# EAGLE design H18R10 (EAGLE 9.6.2)

## Sheet 1 of 2
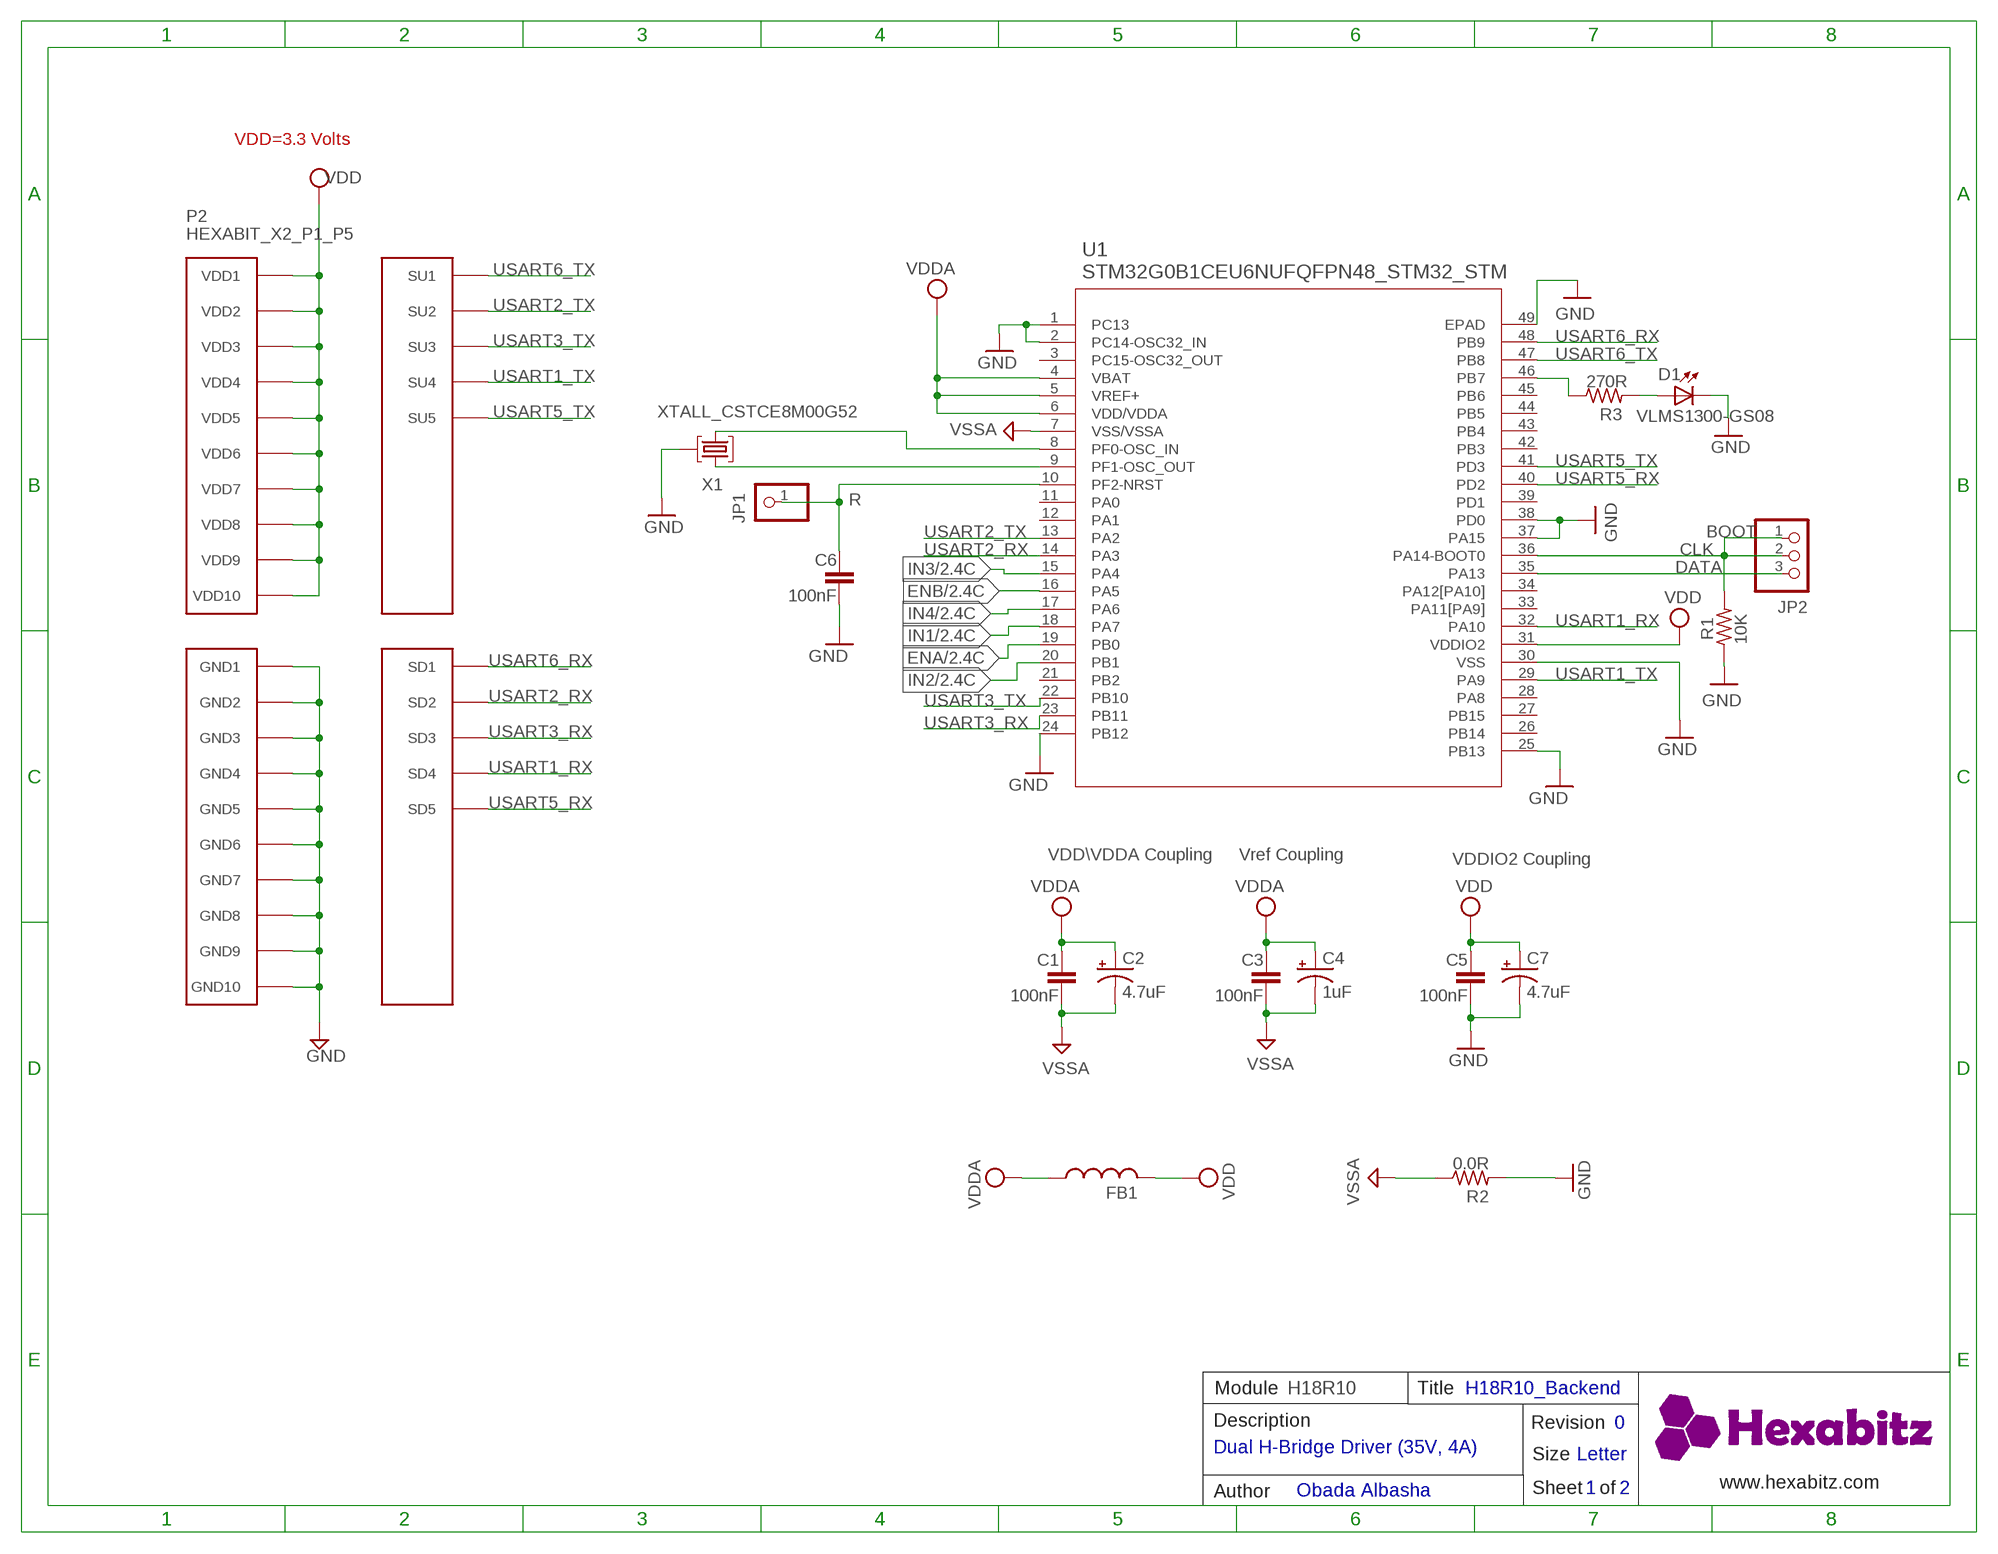
[diagram p0: schematic, sheet 1]

### Parts
C1  100nF  C-0603  [C-0603]
C2  4.7uF  C-0805-POL  [C-0805-POL]
C3  100nF  C-0603  [C-0603]
C4  1uF  C-0805-POL  [C-0805-POL]
C5  100nF  C-0603  [C-0603]
C6  100nF  C-0603  [C-0603]
C7  4.7uF  C-0805-POL  [C-0805-POL]
D1  VLMS1300-GS08  [VLMS1300-GS08]
FB1  FB-0603  [FB-0603]
JP1  R  PINHD-1X1  [1X01]
JP2  PINHD-1X3  [1X03]
P2  HEXABIT_X2_P1_P5  [HEXABIT_17.32_X2_P1_P5]
R1  10K  R-0603  [R-0603]
R2  0.0R  R-0603  [R-0603]
R3  270R  R-0603  [R-0603]
U1  STM32G0B1CEU6NUFQFPN48_STM32_STM  [UFQFPN48_STM32_STM]
X1  XTALL_CSTCE8M00G52  [XTALL_CSTCE8M00G52]

### Nets
CLK: JP2.1 JP2.2 R1.2 U1.36(PA14-BOOT0)
DATA: JP2.3 U1.35(PA13)
ENA: U1.19(PB0) ; also sheet 2
ENB: U1.16(PA5) ; also sheet 2
GND: C5.2 C6.2 C7.2(-) D1.C P2.PAD_PD11(GND1) P2.PAD_PD12(GND2) P2.PAD_PD13(GND3) P2.PAD_PD14(GND4) P2.PAD_PD15(GND5) P2.PAD_PD16(GND6) P2.PAD_PD17(GND7) P2.PAD_PD18(GND8) P2.PAD_PD19(GND9) P2.PAD_PD20(GND10) R1.1 R2.2 U1.1(PC13) U1.2(PC14-OSC32_IN) U1.24(PB12) U1.25(PB13) U1.30(VSS) U1.37(PA15) U1.38(PD0) U1.49(EPAD) X1.P$2 ; also sheet 2
IN1: U1.18(PA7) ; also sheet 2
IN2: U1.20(PB1) ; also sheet 2
IN3: U1.15(PA4) ; also sheet 2
IN4: U1.17(PA6) ; also sheet 2
N$1: D1.A R3.2
N$2: R3.1 U1.46(PB7)
N$5: U1.9(PF1-OSC_OUT) X1.P$1
N$6: U1.8(PF0-OSC_IN) X1.P$3
N$8: C6.1 JP1.1 U1.10(PF2-NRST)
USART1_RX: P2.PAD_PD4(SD4) U1.32(PA10)
USART1_TX: P2.PAD_PU4(SU4) U1.29(PA9)
USART2_RX: P2.PAD_PD2(SD2) U1.14(PA3)
USART2_TX: P2.PAD_PU2(SU2) U1.13(PA2)
USART3_RX: P2.PAD_PD3(SD3) U1.23(PB11)
USART3_TX: P2.PAD_PU3(SU3) U1.22(PB10)
USART5_RX: P2.PAD_PD5(SD5) U1.40(PD2)
USART5_TX: P2.PAD_PU5(SU5) U1.41(PD3)
USART6_RX: P2.PAD_PD1(SD1) U1.48(PB9)
USART6_TX: P2.PAD_PU1(SU1) U1.47(PB8)
VDD: C5.1 C7.1(+) FB1.2 P2.PAD_PU11(VDD1) P2.PAD_PU12(VDD2) P2.PAD_PU13(VDD3) P2.PAD_PU14(VDD4) P2.PAD_PU15(VDD5) P2.PAD_PU16(VDD6) P2.PAD_PU17(VDD7) P2.PAD_PU18(VDD8) P2.PAD_PU19(VDD9) P2.PAD_PU20(VDD10) U1.31(VDDIO2) ; also sheet 2
VDDA: C1.1 C2.1(+) C3.1 C4.1(+) FB1.1 U1.4(VBAT) U1.5(VREF+) U1.6(VDD/VDDA)
VSSA: C1.2 C2.2(-) C3.2 C4.2(-) R2.1 U1.7(VSS/VSSA)
Unconnected: U1.3(PC15-OSC32_OUT) U1.11(PA0) U1.12(PA1) U1.21(PB2) U1.26(PB14) U1.27(PB15) U1.28(PA8) U1.33(PA11[PA9]) U1.34(PA12[PA10]) U1.39(PD1) U1.42(PB3) U1.43(PB4) U1.44(PB5) U1.45(PB6)

### Notes on the sheet
- VDD=3.3 Volts
- BOOT
- VDD\VDDA Coupling | Vref Coupling | VDDIO2 Coupling
- Module | H18R10 | Title | H18R10_Backend
- Description | Revision | 0
- Dual H-Bridge Driver (35V, 4A)
- Size | Letter
- www.hexabitz.com
- Author | Obada Albasha | Sheet   of | 1 | 2
- C:/Users/Admin/Desktop/logodraft.bmp

## Sheet 2 of 2
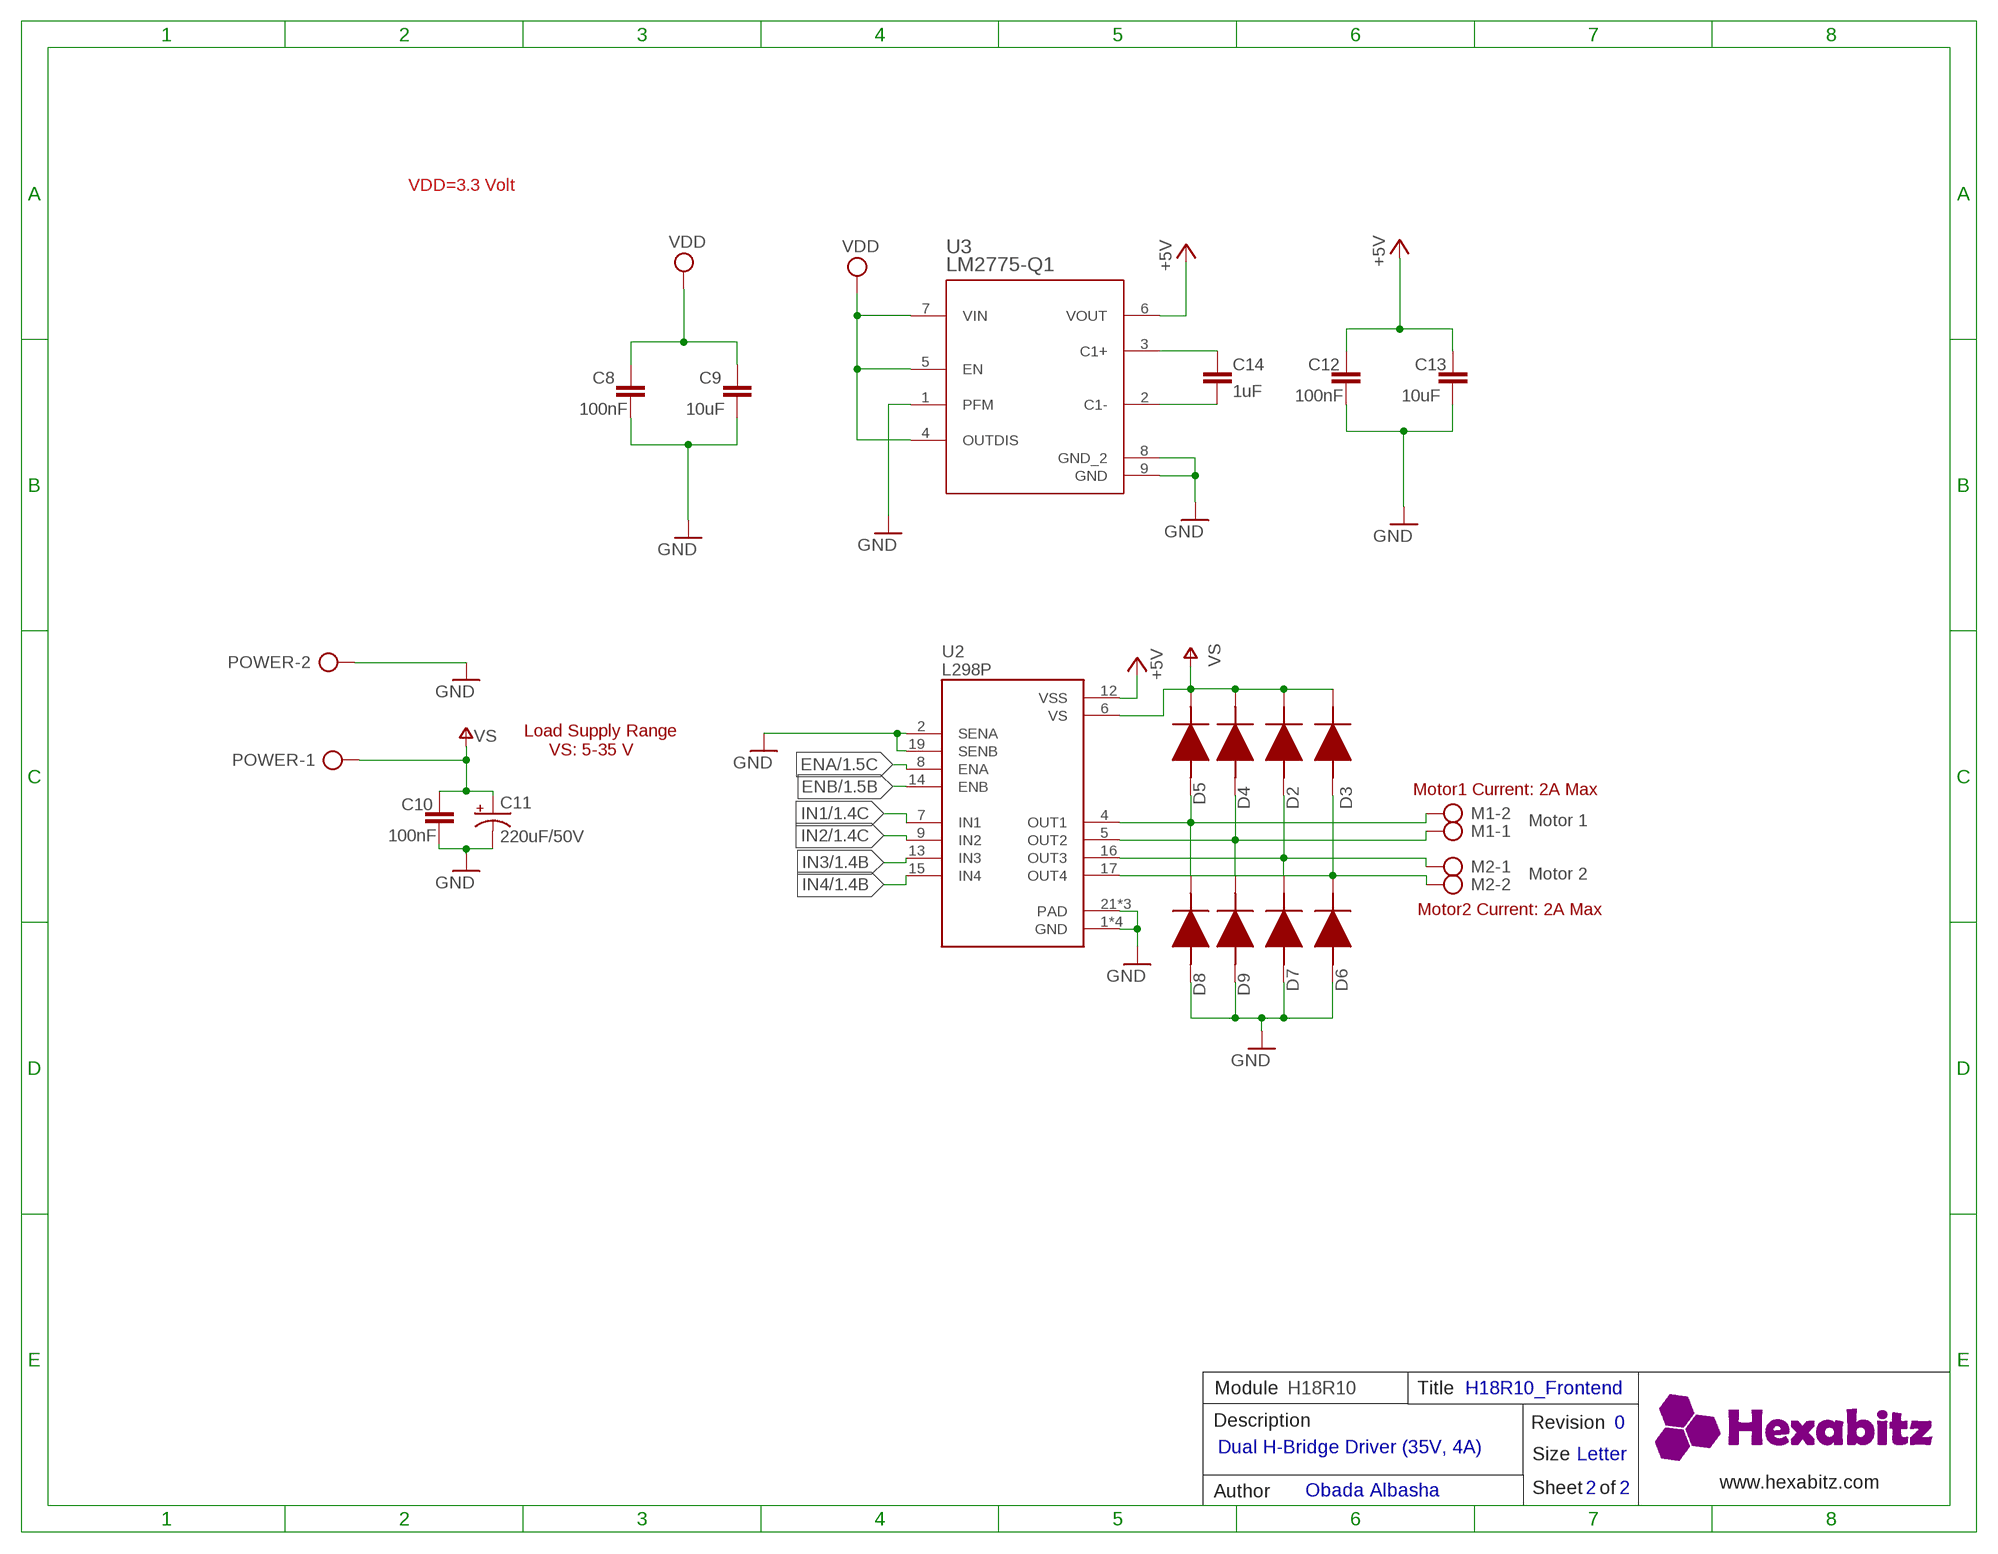
[diagram p1: schematic, sheet 2]

### Parts
C8  100nF  C-0603  [C-0603]
C9  10uF  C-0603  [C-0603]
C10  100nF  C-0603  [C-0603]
C11  220uF/50V  CPOL-USTT5D10  [TT5D10]
C12  100nF  C-0603  [C-0603]
C13  10uF  C-0603  [C-0603]
C14  1uF  C-0603  [C-0603]
D2  MBR120ESFT1G  [SODFL3616X98N]
D3  MBR120ESFT1G  [SODFL3616X98N]
D4  MBR120ESFT1G  [SODFL3616X98N]
D5  MBR120ESFT1G  [SODFL3616X98N]
D6  MBR120ESFT1G  [SODFL3616X98N]
D7  MBR120ESFT1G  [SODFL3616X98N]
D8  MBR120ESFT1G  [SODFL3616X98N]
D9  MBR120ESFT1G  [SODFL3616X98N]
M1  AK500/2  [AK500/2]
M2  AK500/2  [AK500/2]
POWER  AK500/2  [AK500/2]
U2  L298P  [SOIC127P1420X360-20N]
U3  LM2775-Q1  LM2775QDSGRQ1  [DSG0008A]

### Nets
+5V: C12.1 C13.1 U2.12(VSS) U3.6(VOUT)
ENA: U2.8(ENA) ; also sheet 1
ENB: U2.14(ENB) ; also sheet 1
GND: C8.2 C9.2 C10.2 C11.- C12.2 C13.2 D6.2(A) D7.2(A) D8.2(A) D9.2(A) POWER.2 U2.1(GND) U2.2(SENA) U2.10(GND) U2.11(GND) U2.19(SENB) U2.20(GND) U2.21(PAD) U2.22(PAD) U2.23(PAD) U3.1(PFM) U3.8(GND_2) U3.9(GND) ; also sheet 1
IN1: U2.7(IN1) ; also sheet 1
IN2: U2.9(IN2) ; also sheet 1
IN3: U2.13(IN3) ; also sheet 1
IN4: U2.15(IN4) ; also sheet 1
N$3: C14.2 U3.2(C1-)
N$4: C14.1 U3.3(C1+)
N$13: D4.2(A) D9.1(K) M1.1 U2.5(OUT2)
N$14: D2.2(A) D7.1(K) M2.1 U2.16(OUT3)
N$15: D5.2(A) D8.1(K) M1.2 U2.4(OUT1)
N$16: D3.2(A) D6.1(K) M2.2 U2.17(OUT4)
V+: C10.1 C11.+ D2.1(K) D3.1(K) D4.1(K) D5.1(K) POWER.1 U2.6(VS) ; supply symbol labelled VS
VDD: C8.1 C9.1 U3.4(OUTDIS) U3.5(EN) U3.7(VIN) ; also sheet 1

### Notes on the sheet
- VDD=3.3 Volt
- Load Supply Range
       VS: 5-35 V
- Motor1 Current: 2A Max
- Motor 1
- Motor 2
- Motor2 Current: 2A Max
- Module | H18R10 | Title | H18R10_Frontend
- Description | Revision | 0
- Dual H-Bridge Driver (35V, 4A)
- Size | Letter
- www.hexabitz.com
- Author | Obada Albasha | Sheet   of | 2 | 2
- C:/Users/Admin/Desktop/logodraft.bmp

## Library data of the parts
C1 C3 C5 C6 C8-C10 C12-C14 = HEXABITZ_RCLS:C-0603: CAP CER 10% X7R 0603
C2 C4 C7 = HEXABITZ_RCLS:C-0805-POL: Cap Tant Solid SMD 2012
C11 = rcl:CPOL-US: POLARIZED CAPACITOR, American symbol; SPICEPREFIX: C
D1 = Hexabitz:VLMS1300-GS08: Red 0603 130° Clear 54 mcd 2 V Surface Mount ChipLED ; Octopart Url : http://octopart.com/vlms1300-gs08-vishay-21709201; MFN: Vishay; MPN: VLMS1300-GS08; OCTOPART_URL: https://octopart.com/vlms1300-gs08-vishay-21709201?r=sp&s=_gcP4_q8T1SC6PJQPTQ9yA
D2-D9 = HEXABITZ_RCLS:MBR120ESFT1G: Source: Datasheet <http://www.onsemi.com/pub/Collateral/MBR120ESFT1-D.PDF>; ARROW_PART_NUMBER: FSM17PL-TP; ARROW_PRICE-STOCK: https://octopart.com/fsm17pl-tp-mcc-57606818?r=sp; MANUFACTURER_NAME: MCC; MANUFACTURER_PART_NUMBER: FSM17PL-TP; MOUSER_PRICE-STOCK: https://octopart.com/fsm17pl-tp-mcc-57606818?r=sp; PACKAGE: SOD-123FL
FB1 = HEXABITZ_RCLS:FB-0603: Ferrite Beads Multi-Layer 0603
JP1 = HEXABITZ_USER_INTERFACE_PARTS:PINHD-1X1: PIN HEADER; MFN: TE Connectivity; MPN: 87227-1; OCTOPART_URL: https://octopart.com/87227-1-te+connectivity-39512052?r=sp
JP2 = pinhead:PINHD-1X3: PIN HEADER
M1 M2 POWER = HEXABITZ_CONNECTION_PARTS:AK500/2: CONNECTOR; MFN: TE Connectivity; MPN: 282836-2; OCTOPART_URL: https://octopart.com/282836-2-te+connectivity-39396934?r=sp
P2 = hexabitz_connectors:HEXABIT_X2_P1_P5
R1-R3 = HEXABITZ_RCLS:R-0603: Thick Film Resistors - SMD 0603
U1 = HEXABITZ_ICs:STM32G0B1CEU6N; COPYRIGHT: Copyright (C) 2022 Ultra Librarian. All rights reserved.; MFN: STMicroelectronics; MPN: STM32G0B1CEU6N; OCTOPART_URL: https://app.ultralibrarian.com/details/c038d58b-752a-11eb-9033-0a34d6323d74/STMicroelectronics/STM32G0B1CEU6N?uid=116364672
U2 = HEXABITZ_ICs:L298P: L298 Series Dual Full Bridge 4 A 46 V Driver Surface Mount - PowerSO-20 Check availability <https://pricing.snapeda.com/parts/L298P/STMicroelectronics/view-part?ref=eda>; AVAILABILITY: In Stock; DESCRIPTION: Half Bridge (4) Driver DC Motors, Relays, Solenoids, Stepper Motors Bipolar PowerSO-20; MF: STMicroelectronics; MP: L298P; PACKAGE: SO-20 STMicroelectronics; PRICE: None; PURCHASE-URL: https://pricing.snapeda.com/search/part/L298P/?ref=eda
U3 = HEXABITZ_ICs:LM2775QDSGRQ1: Switched Capacitor 5V Boost Converter 8-WSON -40 to 125; MANUFACTURER: Texas Instruments; MFN: Texas Instruments; MPN: LM2775QDSGRQ1; OCTOPART_URL: https://octopart.com/lm2775qdsgrq1-texas+instruments-93339195?r=sp&s=OA7oim0HQqaBsU4tLKFWXg LM2775QDSGRQ1; PARTNUMBER: LM2775QDSGRQ1; REFDES: RefDes; TYPE: TYPE
X1 = Hexabitz:XTALL_CSTCE8M00G52: MURATA CSTCE8M00G52-R0 RESONATOR, SMD, 8MHZ ; Octopart Url : https://octopart.com/cstce8m00g52-r0-murata-7145559; MFN: Murata; MPN: CSTCE8M00G52Z-R0; OCTOPART_URL: https://octopart.com/cstce8m00g52z-r0-murata-17755941?r=sp&s=JDnNJnrHQhyS8Zk4ofFWXw

## Board
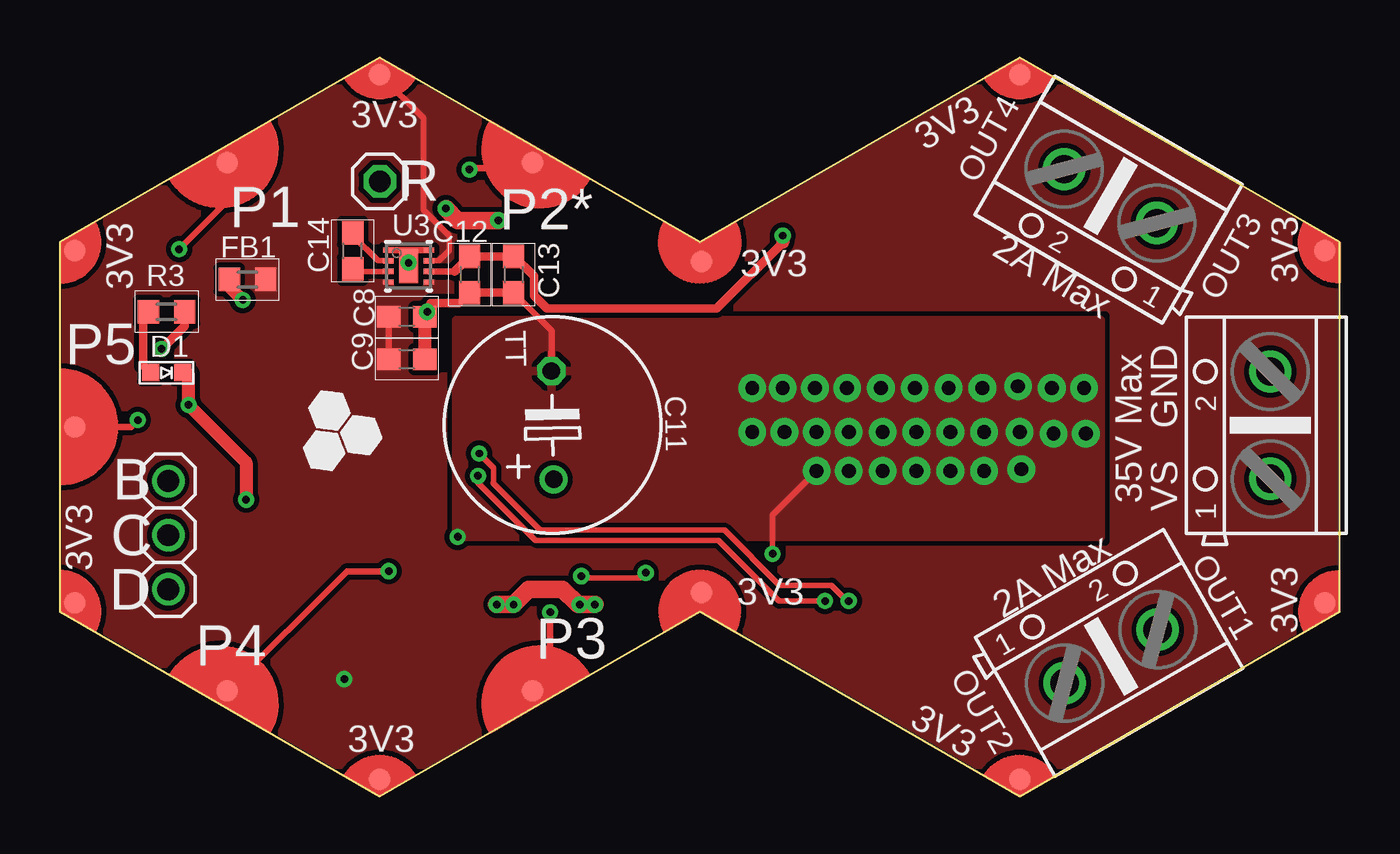
[diagram p2: board, top side]
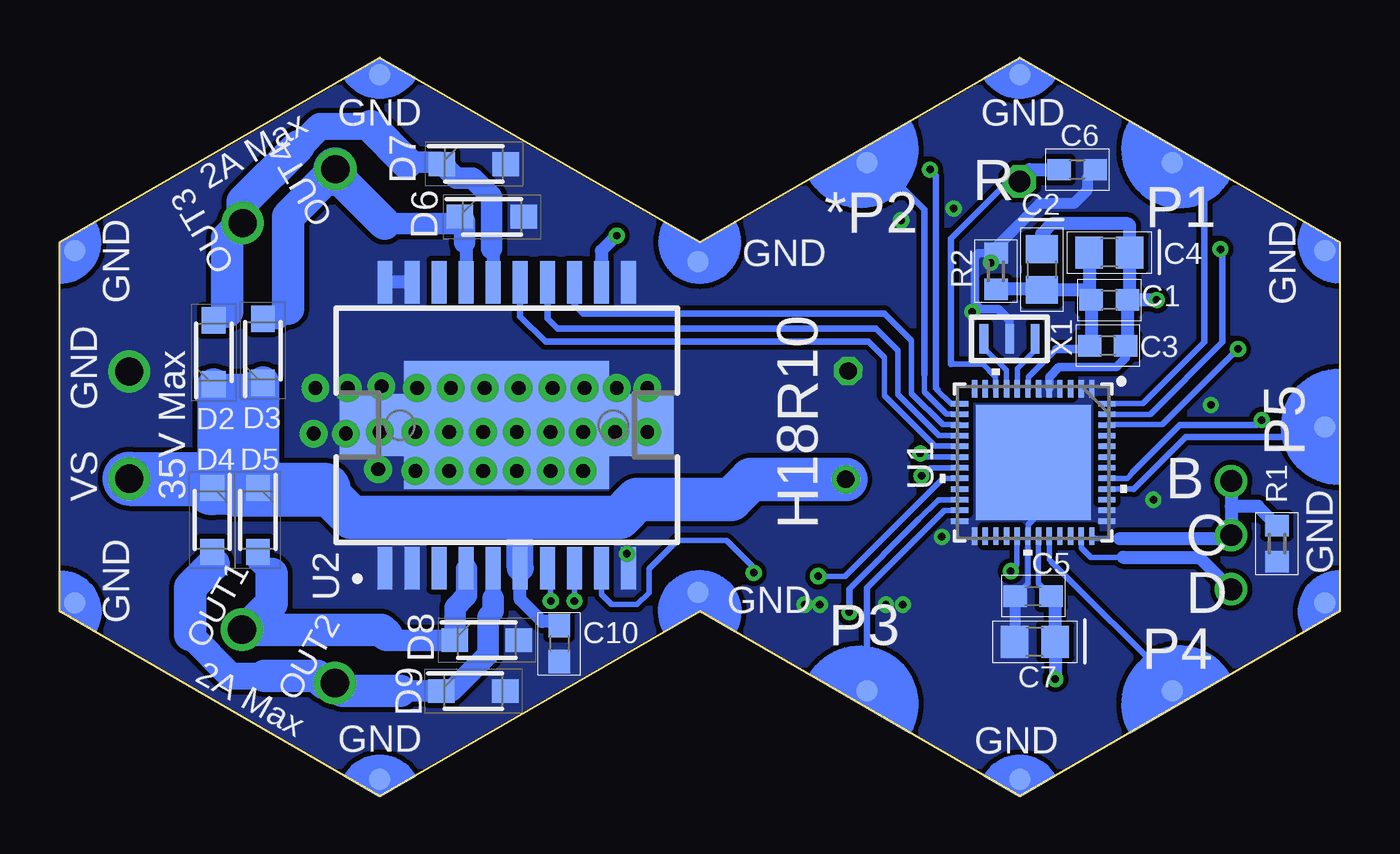
[diagram p3: board, bottom side, seen from below]

Size 60 x 34.64 mm. Coordinates in mm from the lower left corner, seen from the top.
Copper layers (1*16): Top 0.035mm / dielectric 1.5mm / Bottom 0.035mm
Design rules "default *": minimum track width 6mil, minimum drill 0.35mm, track to track 9mil, track to pad 9mil, pad to pad 9mil, via to via 9mil, smd to smd 0mil, copper to edge 1mil, drill to drill 6mil, minimum pad ring 10mil, minimum via ring 8mil, stop-mask expansion 4mil, vias tented up to drill 24mil, thermal gap 10mil

### Footprints (pad centres in the part's own frame; a part is rotated, then mirrored left to right if it is on the bottom)
C-0603 = smd 1.1 x 1: 1 -0.85,0; 2 0.85,0
C-0805-POL = smd 1.3 x 1.5: 1 -0.95,0; 2 0.95,0
TT5D10 = drill 0.813: + -2.54,0 | drill 0.813 octagon: - 2.54,0
VLMS1300-GS08 = smd 0.8 x 0.8: A 0,0.75; C 0,-0.75
SODFL3616X98N = smd 1.24 x 1.12: 1 -1.5,0; 2 1.5,0
FB-0603 = smd 1 x 1.1: 1 -0.85,0; 2 0.85,0
1X01 = drill 1.016 octagon: 1 0,0
1X03 = drill 1.016: 1 -2.54,0; 2 0,0; 3 2.54,0
AK500/2 = drill 1.321: 1 -2.515,0; 2 2.515,0
HEXABIT_17.32_X2_P1_P5 = smd 1 x 1 bottom: PAD_PD1 12.39,22.39; PAD_PD2 12.39,8.09; PAD_PD3 -12.39,8.09; PAD_PD4 -12.39,22.39; PAD_PD5 0,29.55; PAD_PD12 16.52,15.24; PAD_PD13 7.752,0.168; PAD_PD14 16.52,-14.76; PAD_PD15 8.26,-29.07; PAD_PD16 -8.26,-29.07; PAD_PD17 -16.52,-14.76; PAD_PD18 -7.752,0.168; PAD_PD19 -16.52,15.24 | smd 1 x 1 rotated 60 bottom: PAD_PD11 8.26,29.547 | smd 1 x 1 rotated 120 bottom: PAD_PD20 -8.26,29.547 | smd 1 x 1: PAD_PU1 12.39,22.39; PAD_PU2 12.39,8.09; PAD_PU3 -12.39,8.09; PAD_PU4 -12.39,22.39; PAD_PU5 0,29.55; PAD_PU12 16.52,15.24; PAD_PU13 7.752,0.168; PAD_PU14 16.52,-14.76; PAD_PU15 8.26,-29.07; PAD_PU16 -8.26,-29.07; PAD_PU17 -16.52,-14.76; PAD_PU18 -7.752,0.168; PAD_PU19 -16.52,15.24 | smd 1 x 1 rotated 60: PAD_PU11 8.26,29.547 | smd 1 x 1 rotated 120: PAD_PU20 -8.26,29.547
R-0603 = smd 1 x 1.1: 1 -0.85,0; 2 0.85,0
UFQFPN48_STM32_STM = smd 0.813 x 0.254: 1 -3.454,2.751; 2 -3.454,2.251; 3 -3.454,1.75; 4 -3.454,1.25; 5 -3.454,0.75; 6 -3.454,0.25; 7 -3.454,-0.25; 8 -3.454,-0.75; 9 -3.454,-1.25; 10 -3.454,-1.75; 11 -3.454,-2.251; 12 -3.454,-2.751; 25 3.454,-2.751; 26 3.454,-2.251; 27 3.454,-1.75; 28 3.454,-1.25; 29 3.454,-0.75; 30 3.454,-0.25; 31 3.454,0.25; 32 3.454,0.75; 33 3.454,1.25; 34 3.454,1.75; 35 3.454,2.251; 36 3.454,2.751 | smd 0.254 x 0.813: 13 -2.751,-3.454; 14 -2.251,-3.454; 15 -1.75,-3.454; 16 -1.25,-3.454; 17 -0.75,-3.454; 18 -0.25,-3.454; 19 0.25,-3.454; 20 0.75,-3.454; 21 1.25,-3.454; 22 1.75,-3.454; 23 2.251,-3.454; 24 2.751,-3.454; 37 2.751,3.454; 38 2.251,3.454; 39 1.75,3.454; 40 1.25,3.454; 41 0.75,3.454; 42 0.25,3.454; 43 -0.25,3.454; 44 -0.75,3.454; 45 -1.25,3.454; 46 -1.75,3.454; 47 -2.251,3.454; 48 -2.751,3.454 | smd 5.385 x 5.385: 49 0,0
SOIC127P1420X360-20N = smd 2 x 0.7: 1 -6.7,5.715; 2 -6.7,4.445; 3 -6.7,3.175; 4 -6.7,1.905; 5 -6.7,0.635; 6 -6.7,-0.635; 7 -6.7,-1.905; 8 -6.7,-3.175; 9 -6.7,-4.445; 10 -6.7,-5.715; 11 6.7,-5.715; 12 6.7,-4.445; 13 6.7,-3.175; 14 6.7,-1.905; 15 6.7,-0.635; 16 6.7,0.635; 17 6.7,1.905; 18 6.7,3.175; 19 6.7,4.445; 20 6.7,5.715 | smd 6 x 9.6: 21 0,0 | smd 2.9 x 3.05: 22 0,6.3; 23 0,-6.3
DSG0008A = smd 0.5 x 0.25: 1 -0.95,0.75; 2 -0.95,0.25; 3 -0.95,-0.25; 4 -0.95,-0.75; 5 0.95,-0.75; 6 0.95,-0.25; 7 0.95,0.25; 8 0.95,0.75 | smd 0.9 x 1.6: 9 0,0
XTALL_CSTCE8M00G52 = smd 1.4 x 0.4: P$1 0,1.2; P$2 0,0; P$3 0,-1.2

### Placement (x,y rotation side)
C1  10.79,23.27 180 bottom
C2  13.97,24.7 270 bottom
C3  10.87,21.13 180 bottom
C4  10.79,25.5 180 bottom
C5  14.37,9.38 180 bottom
C6  12.3,29.38 0 bottom
C7  14.29,7.24 180 bottom
C8  16.27,22.48 0 top
C9  16.27,20.5 0 top
C10  36.59,7.15 270 bottom
C11  23.1,17.4 91.2 top
C12  19.21,24.46 270 top
C13  21.27,24.46 270 top
C14  13.73,25.57 90 top
D1  5,19.86 90 top
D2  52.78,20.81 90 bottom
D3  50.48,20.89 90 bottom
D4  52.86,12.95 270 bottom
D5  50.72,12.95 270 bottom
D6  39.74,27.17 0 bottom
D7  40.58,29.65 0 bottom
D8  39.98,7.32 0 bottom
D9  40.61,4.93 0 bottom
FB1  8.79,24.23 0 top
JP1  15,28.83 0 top
JP2  5.08,12.24 270 top
M1  49.29,6.56 29.9 top
M2  49.26,28.14 149.9 top
P2  30.24,17.32 90 top
POWER  56.75,17.4 90 top
R1  2.93,11.84 90 bottom
R2  16.11,24.62 90 bottom
R3  5,22.72 180 top
U1  14.37,15.65 270 bottom
U2  39.05,17.4 90 bottom
U3  16.35,24.86 0 top
X1  15.48,21.45 90 bottom

### Tracks (layer width: path | path; a pad name or v marks a point on that pad's centre or on a via)
+5V  (via drill 0.35)
  Top 0.305: U3.6 18.5,24.61
  Top 0.406: 18.5,24.61 C12.1 C13.1 21.29,25.31 22.22,24.38 22.22,23.49 22.83,22.88 30.8,22.88 33.89,25.97
  Top 0.61: v33.89,26.29 33.89,25.97
  Bottom 0.61: v33.89,26.29 34.61,25.57 U2.12
CLK
  Bottom 0.254: U1.36 11.5,12.08 10.32,12.08
  Bottom 0.61: 10.32,12.08 5.24,12.08 JP2.2 5.08,13.59 | JP2.1 5.08,13.59 | R1.2 3.83,13.59 5.08,13.59
DATA
  Bottom 0.254: U1.35 12.1,12.18 12.1,11.64 11.66,11.21 10.16,11.21
  Bottom 0.61: 10.16,11.21 6.59,11.21 JP2.3
ENA  (via drill 0.35)
  Top 0.254: v35.88,9.16 33.72,9.16 30.87,12 22.3,12 19.6,14.7 v19.6,15.02
  Bottom 0.254: U1.19 19.22,15.4 v19.6,15.02 | v35.88,9.16 U2.8
ENB
  Bottom 0.254: U1.16 17.84,16.92 18.79,16.92 20.71,18.85 20.71,20.89 21.75,21.92 | 36.59,21.92 36.67,21.92
  Bottom 0.305: 21.75,21.92 36.59,21.92 | 36.67,21.92 37.15,22.4 U2.14
GND  (via drill 0.35, 0.65 pad 1.3)
  Top 0.254: U3.9 v16.35,25.02 | v33.41,11.37 33.41,13.19 v35.48,15.26
  Top 0.305: 21.29,23.59 C13.2 23.04,21.84 C11.- | U3.1 16.27,25.61 | 16.27,25.61 U3.8 | U3.9 16.27,24.94 16.27,25.61 | 18.71,23.11 C12.2 | C8.2 17.12,22.61 v17.22,22.72
  Top 0.406: C12.2 C13.2 | 18.71,23.11 17.38,23.11 17.38,22.58
  Top 0.61: D1.C 6.03,19.79 v6.03,18.35 8.73,15.65 v8.73,13.91 | C9.2 C8.2
  Top 0.813: v20.56,27 18.65,27 v18.1,27.56 | v20.48,8.99 v21.27,8.99 21.98,9.7 23.57,9.7 24.29,8.99 v24.37,8.99 v25.08,8.99
  Bottom 0.254: C5.2 14.61,9.98 U1.30 14.6,12.22 14.6,12.75 14.36,12.98 U1.49 | 16.19,25.47 R2.2
  Bottom 0.406: X1.P$2 15.48,22.32 16,22.84 16.84,22.84 17.09,23.09 17.09,25.31 16.93,25.47 16.38,25.47
  Bottom 0.508: C5.2 15.21,7.26 C7.2 | 16.38,25.47 14.06,27.8 12.46,27.8 11.83,28.43 11.83,29.01 C6.2
  Bottom 0.61: U2.19 U2.20
  other vias: 18.65,12.16 43.26,19.15 41.67,19.15 40.08,19.15 38.49,19.15 36.91,19.15 35.4,19.15 43.34,17.08 41.75,17.08 40.16,17.08 38.57,17.08 36.99,17.08 35.48,17.08 43.34,15.26 41.75,15.26 40.16,15.26 38.57,15.26 36.99,15.26 32.46,17.08 32.46,19.15 48.1,17 44.92,19.23 45,17.08 45.08,15.34 33.89,19.15 33.97,17.08 46.51,19.15 46.59,17 48.02,19.15
  pour Bottom (no thermals): 29.92,26.13 15.08,34.62 0.16,26.05 0.08,8.75 15,0.02 30,8.59 45,0.02 60.09,8.59 60.09,25.89 45.16,34.62 30,25.97 29.76,26.21
  pour Top: 48.81,22.32 18.57,22.32 18.57,12.16 48.81,12.16
IN1  (via drill 0.35)
  Top 0.254: v36.99,9.16 36.91,9.16 36.18,9.89 33.75,9.89 31.15,12.48 22.5,12.48 20.3,14.68 20.34,14.71 20.34,15.4 v19.66,16.07
  Bottom 0.254: U2.7 36.99,10.54 v36.99,9.16 36.99,9.14 | v19.66,16.07 19.66,15.9 19.57,15.9 U1.18
IN2  (via drill 0.35)
  Top 0.254: v24.45,10.32 24.52,10.24 27.23,10.24 v27.47,10.47
  Bottom 0.254: U1.20 18.61,14.9 23.19,10.32 v24.45,10.32 | 34.68,10.89 34.61,10.81 U2.9 34.61,9.46 34.13,8.99 32.94,8.99 32.38,9.54 32.38,10.65 31.03,12 28.76,12 27.47,10.71 v27.47,10.47
IN3
  Bottom 0.254: U1.15 17.84,17.42 18.61,17.42 20.08,18.89 20.08,21.37 21.35,22.64
  Bottom 0.305: 21.35,22.64 35.48,22.64 35.88,23.04 U2.13
IN4
  Bottom 0.254: U1.17 17.84,16.42 18.97,16.42 21.35,18.8 21.35,20.57 22.09,21.31
  Bottom 0.305: 22.09,21.31 37.22,21.31 38.42,22.5 U2.15
N$1
  Top 0.406: R3.2 3.91,22.48 3.91,20.2 D1.A
N$2  (via drill 0.35)
  Top 0.406: R3.1 5.85,22.06 v4.76,20.97
  Bottom 0.254: v4.76,20.97 8.31,17.42 10.89,17.42 U1.46
N$3
  Top 0.254: U3.2 14.91,25.11 13.73,26.29 C14.2
N$4
  Top 0.254: U3.3 13.84,24.61 C14.1
N$5
  Bottom 0.254: U1.9 15.63,19.12 15.63,19.98 16.68,21.02 X1.P$1
N$6
  Bottom 0.254: X1.P$3 14.28,20.89 15.11,20.05 U1.8
N$8
  Bottom 0.254: U1.10 16.13,19.12 16.13,19.66 16.73,20.26 18.23,20.26
  Bottom 0.305: 18.23,20.26 18.23,26.15 15.56,28.83 15.08,28.83 JP1.1
  Bottom 0.508: 15.08,28.83 14.52,29.38
  Bottom 0.61: 14.52,29.38 C6.1
N$13
  Bottom 0.61: U2.5 39.69,9.3
  Bottom 1.016: D9.1 | D9.1 44.05,4.94 | D4.2 52.79,11.38 52.79,10.89 | D9.1 41.64,4.94 39.92,6.65 39.92,8.43 39.69,8.67 39.69,9.3
  Bottom 1.27: 50.4,5.65 51.99,5.65 53.89,7.56
  Bottom 1.524: 44.05,4.94 46.74,4.94 M1.1 47.59,5.3 47.93,5.65 50.4,5.65 | 53.89,7.56 53.89,9.79 52.79,10.89
N$14
  Bottom 0.61: 39.76,25.69 39.69,25.61 U2.16
  Bottom 1.016: D7.1 41.93,29.65 | D2.2 52.38,22.72 52.15,22.72 | D7.1 42.16,29.73 43.52,29.73 43.55,29.7 43.73,29.7 | 39.76,25.69 39.76,28.11 40,28.35 40.01,28.35 40.65,28.99 41.42,28.99 D7.1
  Bottom 1.27: 48.81,30.5 48.73,30.5 47.81,31.42 45.45,31.42 45.44,31.41
  Bottom 1.524: 52.15,22.72 52.15,26.17 M2.1 51.44,27.87 48.81,30.5 | 45.44,31.41 43.73,29.7
N$15
  Bottom 0.61: U2.4 40.92,10.67
  Bottom 1.016: 50.08,10.41 50.72,11.05 D5.2 | 41.51,7.35 D8.1 | D8.1 44.45,7.32 44.69,7.56 | 40.92,10.67 40.92,9.83 40.93,9.82 40.93,9.41 41.48,8.86 D8.1
  Bottom 1.524: 50.08,10.41 50.08,9.03 51.3,7.81 M1.2 | M1.2 51.3,7.64 | 44.69,7.56 44.94,7.81 M1.2
N$16
  Top 1.016: 47.02,29.43 M2.2
  Bottom 0.61: 41.03,25.97 40.96,25.89 U2.17
  Bottom 1.016: 47.34,29.43 M2.2 47.1,29.34 | D3.2 49.77,22.39 49.29,22.88 | 44.77,26.84 41.57,26.84 D6.1 41.03,26.97 41.03,25.97
  Bottom 1.524: 49.29,22.88 49.29,25.62 49.31,25.64 49.31,27.18 M2.2 | 44.77,26.84 47.09,29.16
  Bottom 2.032: 47.09,29.16 M2.2
USART1_RX
  Bottom 0.254: 13.49,10.97 13.61,11.09 U1.32
  Bottom 0.305: 13.49,10.97 7.85,5.33 P2.PAD_PD4
USART1_TX  (via drill 0.35)
  Top 0.305: P2.PAD_PU4 13.47,10.55 v15.42,10.55
  Bottom 0.254: U1.29 15.13,12.18 15.13,10.84 v15.42,10.55
USART2_RX
  Bottom 0.254: U1.14 17.84,17.92 18.42,17.92 19.46,18.96 19.46,19.78
  Bottom 0.305: P2.PAD_PD2 21.67,29.71 19.46,27.5 19.46,19.78
USART2_TX  (via drill 0.35)
  Top 0.305: P2.PAD_PU2 22.15,29.46 19.29,29.46 v19.21,29.38
  Bottom 0.254: U1.13 18.22,18.4 18.85,19.03 18.85,19.07
  Bottom 0.305: v19.21,29.38 18.93,29.11 18.93,19.15 18.85,19.07
USART3_RX
  Bottom 0.254: U1.23 18.52,13.4 22.15,9.77
  Bottom 0.305: P2.PAD_PD3 22.15,9.77
USART3_TX  (via drill 0.35)
  Top 0.305: v22.99,8.63 22.99,5.77 P2.PAD_PU3
  Bottom 0.254: U1.22 18.81,13.9 19.77,12.95
  Bottom 0.305: 19.77,12.95 22.99,9.73 v22.99,8.63
USART5_RX
  Bottom 0.254: U1.40 9.64,14.4
  Bottom 0.305: P2.PAD_PD5 1.17,16.84 7.2,16.84 9.64,14.4
USART5_TX  (via drill 0.35)
  Top 0.305: v3.65,17.64 3.33,17.32 P2.PAD_PU5
  Bottom 0.254: U1.41 9.96,14.9 9.66,15.2 9.68,15.2
  Bottom 0.305: v3.65,17.64 3.89,17.4 7.48,17.4 9.68,15.2
USART6_RX
  Bottom 0.254: U1.48 9.23,18.4 6.35,21.29
  Bottom 0.305: P2.PAD_PD1 6.35,28.21 6.35,21.29
USART6_TX  (via drill 0.35)
  Top 0.305: P2.PAD_PU1 7.85,27.91 v5.59,25.65
  Bottom 0.254: U1.47 8.88,17.9 5.5,21.29
  Bottom 0.305: v5.59,25.65 5.5,25.56 5.5,21.29
V+
  Bottom 0.254: D5.1 51.67,14.45 51.75,14.38
  Bottom 0.406: C10.1 36.78,8.19
  Bottom 0.61: 36.78,8.19 37.38,8.19 38.42,9.22 U2.6
  Bottom 1.016: D3.1 51.04,19.39 51.04,19.31 D2.1
  Bottom 1.27: U2.6 38.42,13.07
  Bottom 1.524: D5.1 50.48,14.69 D3.1 | D4.1 52.78,14.53 D2.1 51.9,18.43 51.59,18.43 51.59,15.57 52.28,14.89 POWER.1
  Bottom 2.032: 47.63,14.38 46.33,13.07 38.42,13.07 33.77,13.07 32.93,13.91 28.54,13.91 27.59,14.86 C11.+
  Bottom 2.54: 51.75,14.38 47.63,14.38 | POWER.1 53.13,14.89 52.78,14.53 | D5.1 D4.1
VDD  (via drill 0.35)
  Top 0.254: U3.7 17.79,25.11 18.25,25.57 18.25,26.28 17.04,27.49 17.04,31.8 P2.PAD_PU12
  Top 0.305: C8.1 15.4,22.5 15.4,22.64 15.42,22.62 C9.1
  Bottom 0.254: U1.31 14.11,9.98 13.62,9.49 C5.1
  Bottom 0.508: 13.34,9.2 13.62,9.49 | v13.34,5.5 v13.33,5.49
  Bottom 0.61: 13.34,9.2 C7.1 v13.34,5.5
  pour Top (rank 5, no thermals): 0,26.13 0,8.75 0.08,8.67 14.92,0.02 30.08,8.51 45,0.02 60.09,8.59 60.09,25.89 45.08,34.7 30.16,26.05 15.2,34.76 0.15,26.13
VDDA  (via drill 0.35)
  Top 0.61: v8.57,23.27 7.94,23.9 FB1.1
  Bottom 0.406: U1.5 13.61,19.66 13.16,20.12 10.48,20.12 10.02,20.57 C3.1
  Bottom 0.508: C1.1 9.84,23.37 | 9.84,26.77 9.92,26.84
  Bottom 0.61: C3.1 9.94,21.21 C1.1 v8.57,23.27 | 9.84,23.37 C4.1 9.84,26.77 | 9.92,26.84 13.49,26.84 13.97,26.37 C2.1
  pour Bottom (no thermals): 13.09,19.46 13.09,18.75 14.13,18.75 14.13,19.46
VSSA
  Bottom 0.254: 11.88,20.97 C3.2 | U1.7 14.6,19.12 14.6,19.66 13.29,20.97
  Bottom 0.406: 13.29,20.97 11.88,20.97
  Bottom 0.508: 11.9,23.53 C1.2 | C2.2 13.99,23.77
  Bottom 0.61: C4.2 11.74,23.75 11.9,23.75 | 11.9,23.75 11.9,23.53 | C1.2 11.64,21.21 C3.2 | C2.2 11.9,23.75 | 13.99,23.77 R2.1

### Text on the board
bPlace: H18R10
tNames: 3V3 | R | 3V3 | P2* | OUT4 | 3V3 | P1 | 2A Max | 3V3 | 3V3 | OUT3 | GND | P5 | VS | B | 35V Max | 3V3 | C | OUT1 | D | 3V3 | 2A Max | 3V3 | P4 | P3 | OUT2 | 3V3 | 3V3
bNames: GND | GND | R | *P2 | 2A Max | GND | P1 | OUT4 | GND | OUT3 | GND | P5 | GND | B | GND | 35V Max | VS | C | GND | D | GND | P3 | OUT1 | P4 | 2A Max | OUT2 | GND | GND